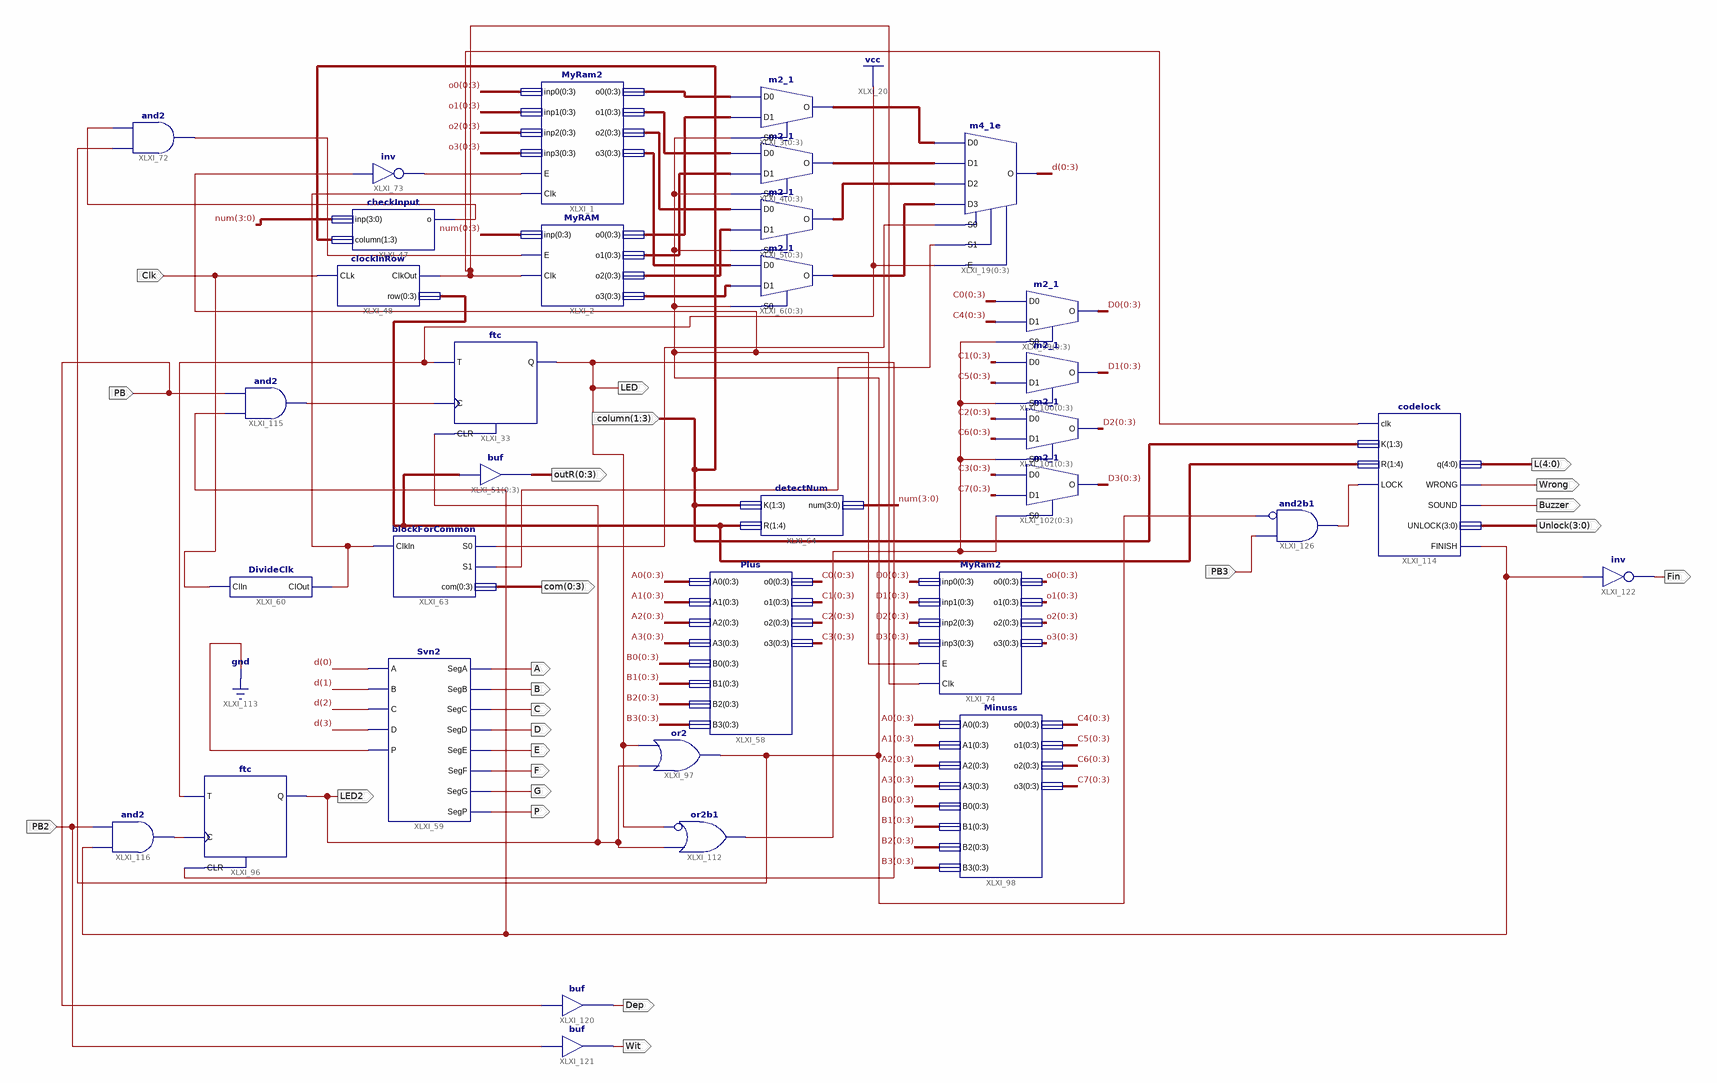
[diagram p0: schematic sheet 1]
// Xilinx ISE schematic res.sch (spartan6) as structural Verilog: 34 symbols, 24 ports
module res (
  input  [1:3] column,
  input  PB3,
  input  Clk,
  input  PB,
  input  PB2,
  output [0:3] outR,
  output [0:3] com,
  output LED2,
  output LED,
  output Wrong,
  output Buzzer,
  output [3:0] Unlock,
  output A,
  output B,
  output C,
  output D,
  output E,
  output F,
  output G,
  output P,
  output Dep,
  output Wit,
  output [4:0] L,
  output Fin
);

  wire LED3, XLXN_289, XLXN_290, XLXN_294, XLXN_322, XLXN_323, XLXN_327, XLXN_424, XLXN_460, XLXN_500,
       XLXN_502, XLXN_522, XLXN_549;
  wire [3:0] A0, A1, A2, A3, B0, B1, B2, B3, C0, C1, C2, C3, C4, C5, C6, C7, D0, D1, D2, D3, D_bus, num, o0,
       o1, o2, o3, r, XLXN_45, XLXN_46, XLXN_48, XLXN_51;

  MyRam2 XLXI_1 (
    .Clk(XLXN_294), .E(XLXN_327), .inp0({o0[0], o0[1], o0[2], o0[3]}), .inp1({o1[0], o1[1], o1[2], o1[3]}),
    .inp2({o2[0], o2[1], o2[2], o2[3]}), .inp3({o3[0], o3[1], o3[2], o3[3]}),
    .o0({A0[0], A0[1], A0[2], A0[3]}), .o1({A1[0], A1[1], A1[2], A1[3]}), .o2({A2[0], A2[1], A2[2], A2[3]}),
    .o3({A3[0], A3[1], A3[2], A3[3]}));
  m2_1 XLXI_4[0:3] (
    .D0({A1[0], A1[1], A1[2], A1[3]}), .D1({B1[0], B1[1], B1[2], B1[3]}), .S0(LED3),
    .O({XLXN_45[0], XLXN_45[1], XLXN_45[2], XLXN_45[3]}));
  m2_1 XLXI_5[0:3] (
    .D0({A2[0], A2[1], A2[2], A2[3]}), .D1({B2[0], B2[1], B2[2], B2[3]}), .S0(LED3),
    .O({XLXN_46[0], XLXN_46[1], XLXN_46[2], XLXN_46[3]}));
  m2_1 XLXI_6[0:3] (
    .D0({A3[0], A3[1], A3[2], A3[3]}), .D1({B3[0], B3[1], B3[2], B3[3]}), .S0(LED3),
    .O({XLXN_51[0], XLXN_51[1], XLXN_51[2], XLXN_51[3]}));
  m2_1 XLXI_3[0:3] (
    .D0({A0[0], A0[1], A0[2], A0[3]}), .D1({B0[0], B0[1], B0[2], B0[3]}), .S0(LED3),
    .O({XLXN_48[0], XLXN_48[1], XLXN_48[2], XLXN_48[3]}));
  m4_1e XLXI_19[0:3] (
    .D0({XLXN_48[0], XLXN_48[1], XLXN_48[2], XLXN_48[3]}),
    .D1({XLXN_45[0], XLXN_45[1], XLXN_45[2], XLXN_45[3]}),
    .D2({XLXN_46[0], XLXN_46[1], XLXN_46[2], XLXN_46[3]}),
    .D3({XLXN_51[0], XLXN_51[1], XLXN_51[2], XLXN_51[3]}), .E(1'b1), .S0(XLXN_289), .S1(XLXN_290),
    .O({D_bus[0], D_bus[1], D_bus[2], D_bus[3]}));
  MyRAM XLXI_2 (
    .Clk(XLXN_424), .E(XLXN_323), .inp({num[0], num[1], num[2], num[3]}), .o0({B0[0], B0[1], B0[2], B0[3]}),
    .o1({B1[0], B1[1], B1[2], B1[3]}), .o2({B2[0], B2[1], B2[2], B2[3]}), .o3({B3[0], B3[1], B3[2], B3[3]}));
  assign outR = {r[0], r[1], r[2], r[3]};  // buf XLXI_51[0..3], 4 bits wide
  Plus XLXI_58 (
    .A0({A0[0], A0[1], A0[2], A0[3]}), .A1({A1[0], A1[1], A1[2], A1[3]}), .A2({A2[0], A2[1], A2[2], A2[3]}),
    .A3({A3[0], A3[1], A3[2], A3[3]}), .B0({B0[0], B0[1], B0[2], B0[3]}), .B1({B1[0], B1[1], B1[2], B1[3]}),
    .B2({B2[0], B2[1], B2[2], B2[3]}), .B3({B3[0], B3[1], B3[2], B3[3]}), .o0({C0[0], C0[1], C0[2], C0[3]}),
    .o1({C1[0], C1[1], C1[2], C1[3]}), .o2({C2[0], C2[1], C2[2], C2[3]}), .o3({C3[0], C3[1], C3[2], C3[3]}));
  clockInRow XLXI_48 (.CLk(Clk), .ClkOut(XLXN_424), .row({r[0], r[1], r[2], r[3]}));
  DivideClk XLXI_60 (.ClIn(Clk), .ClOut(XLXN_294));
  ftc XLXI_33 (.C(XLXN_502), .CLR(LED2), .T(1'b1), .Q(LED));
  blockForCommon XLXI_63 (.ClkIn(XLXN_294), .com(com), .S0(XLXN_289), .S1(XLXN_290));
  detectNum XLXI_64 (.K(column), .R({r[0], r[1], r[2], r[3]}), .num(num));
  checkInput XLXI_47 (.column(column), .inp(num), .o(XLXN_322));
  not XLXI_73 (XLXN_327, LED3);
  MyRam2 XLXI_74 (
    .Clk(XLXN_424), .E(LED3), .inp0({D0[0], D0[1], D0[2], D0[3]}), .inp1({D1[0], D1[1], D1[2], D1[3]}),
    .inp2({D2[0], D2[1], D2[2], D2[3]}), .inp3({D3[0], D3[1], D3[2], D3[3]}),
    .o0({o0[0], o0[1], o0[2], o0[3]}), .o1({o1[0], o1[1], o1[2], o1[3]}), .o2({o2[0], o2[1], o2[2], o2[3]}),
    .o3({o3[0], o3[1], o3[2], o3[3]}));
  Svn2 XLXI_59 (
    .A(D_bus[0]), .B(D_bus[1]), .C(D_bus[2]), .D(D_bus[3]), .P(1'b0), .SegA(A), .SegB(B), .SegC(C), .SegD(D),
    .SegE(E), .SegF(F), .SegG(G), .SegP(P));
  ftc XLXI_96 (.C(XLXN_500), .CLR(LED), .T(1'b1), .Q(LED2));
  or XLXI_97 (LED3, LED2, LED);
  Minuss XLXI_98 (
    .A0({A0[0], A0[1], A0[2], A0[3]}), .A1({A1[0], A1[1], A1[2], A1[3]}), .A2({A2[0], A2[1], A2[2], A2[3]}),
    .A3({A3[0], A3[1], A3[2], A3[3]}), .B0({B0[0], B0[1], B0[2], B0[3]}), .B1({B1[0], B1[1], B1[2], B1[3]}),
    .B2({B2[0], B2[1], B2[2], B2[3]}), .B3({B3[0], B3[1], B3[2], B3[3]}), .o0({C4[0], C4[1], C4[2], C4[3]}),
    .o1({C5[0], C5[1], C5[2], C5[3]}), .o2({C6[0], C6[1], C6[2], C6[3]}), .o3({C7[0], C7[1], C7[2], C7[3]}));
  m2_1 XLXI_99[0:3] (
    .D0({C0[0], C0[1], C0[2], C0[3]}), .D1({C4[0], C4[1], C4[2], C4[3]}), .S0(XLXN_460),
    .O({D0[0], D0[1], D0[2], D0[3]}));
  m2_1 XLXI_100[0:3] (
    .D0({C1[0], C1[1], C1[2], C1[3]}), .D1({C5[0], C5[1], C5[2], C5[3]}), .S0(XLXN_460),
    .O({D1[0], D1[1], D1[2], D1[3]}));
  m2_1 XLXI_102[0:3] (
    .D0({C3[0], C3[1], C3[2], C3[3]}), .D1({C7[0], C7[1], C7[2], C7[3]}), .S0(XLXN_460),
    .O({D3[0], D3[1], D3[2], D3[3]}));
  m2_1 XLXI_101[0:3] (
    .D0({C2[0], C2[1], C2[2], C2[3]}), .D1({C6[0], C6[1], C6[2], C6[3]}), .S0(XLXN_460),
    .O({D2[0], D2[1], D2[2], D2[3]}));
  or XLXI_112 (XLXN_460, ~LED, LED2);  // or2b1
  codelock XLXI_114 (
    .clk(XLXN_424), .LOCK(XLXN_549), .K(column), .R({r[0], r[1], r[2], r[3]}), .WRONG(Wrong),
    .FINISH(XLXN_522), .SOUND(Buzzer), .q(L), .UNLOCK(Unlock));
  and XLXI_115 (XLXN_502, XLXN_522, PB);
  and XLXI_116 (XLXN_500, XLXN_522, PB2);
  buf XLXI_120 (Dep, PB);
  buf XLXI_121 (Wit, PB2);
  not XLXI_122 (Fin, XLXN_522);
  and XLXI_72 (XLXN_323, LED3, XLXN_322);
  and XLXI_126 (XLXN_549, ~LED3, PB3);  // and2b1
endmodule
